# Altium project Buck Converter.PrjPcb
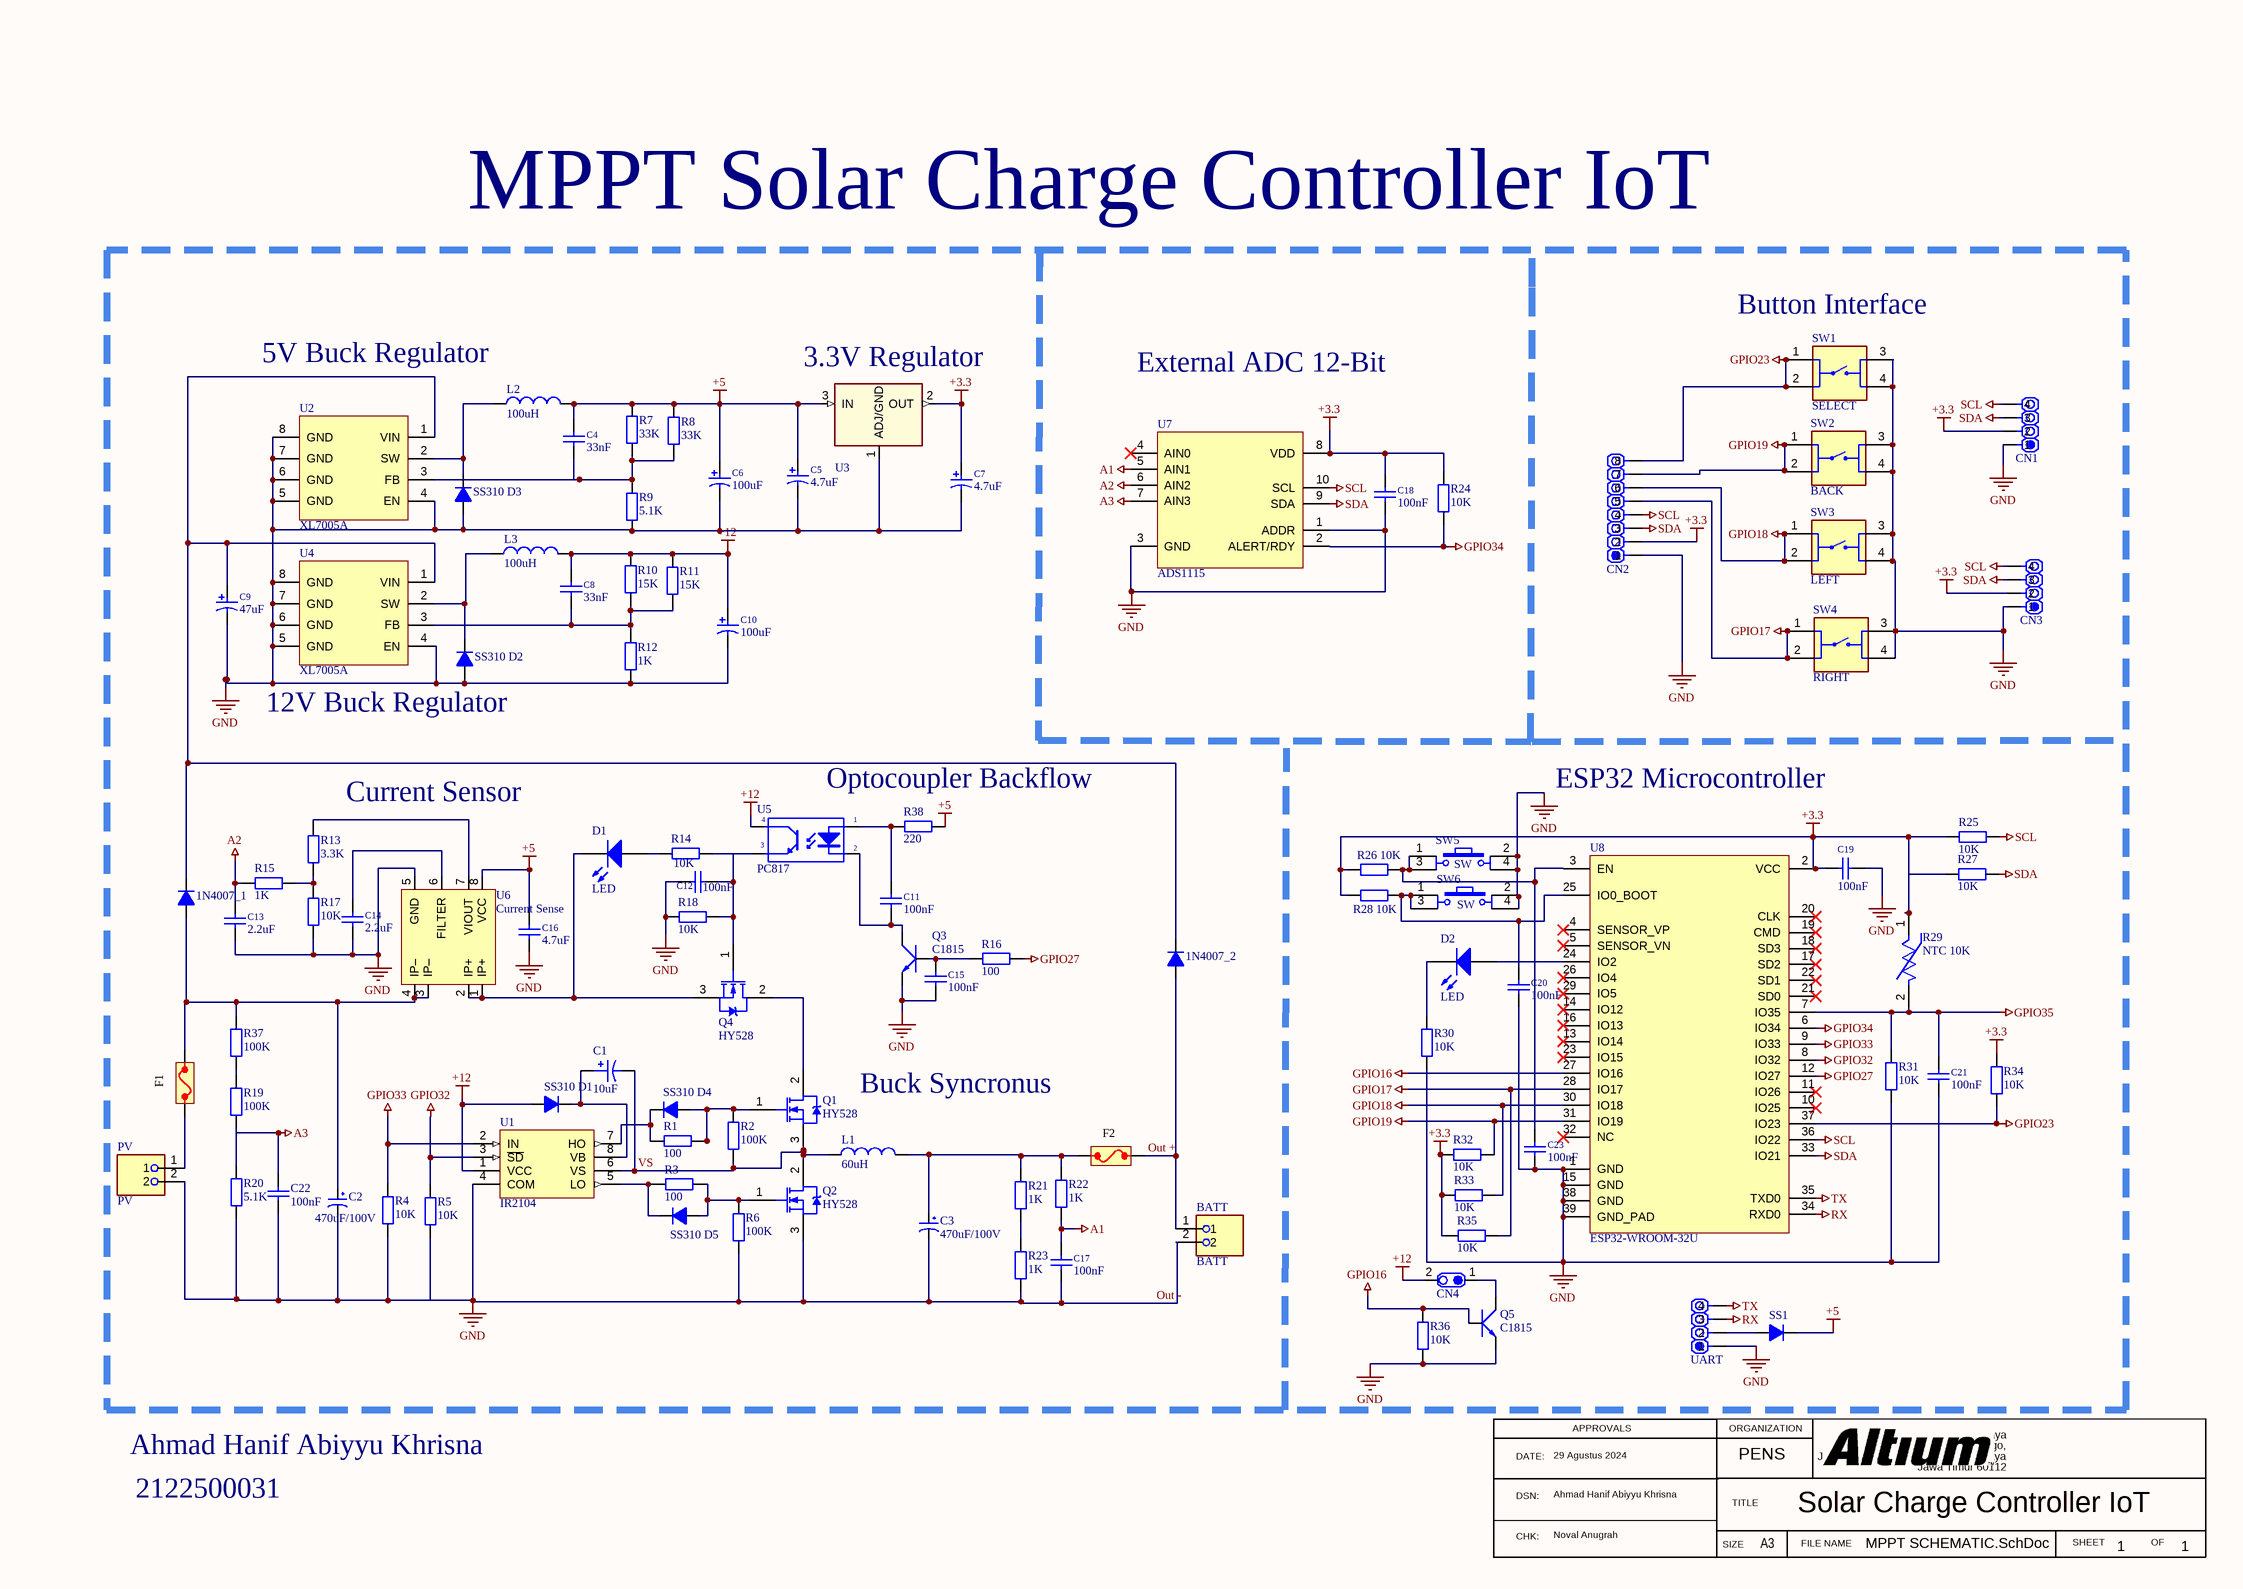
[diagram p0: MPPT SCHEMATIC.SchDoc]
1 sheet, 102 parts. Net scope: global (net labels, ports and power ports of the same name join across sheets).
Board files: MPPT PCB.PcbDoc, ButtonInterface.PcbDoc, Project MPPT.PcbDoc

## Sheet MPPT SCHEMATIC.SchDoc: Solar Charge Controller IoT
size 420 x 297 mm; Date: 29 Agustus 2024; CheckedBy: Noval Anugrah; DrawnBy: Ahmad Hanif Abiyyu Khrisna; Engineer: Ahmad Hanif Abiyyu Khrisna; Organization: PENS; Address1: PT Agraprana Cahya Wijaya; Address2: Pakuwon City Cluster San Diego,; Address3: Jalan Kalisari Permai M3-27, Surabaya; Address4: Jawa Timur 60112; SheetNumber: 1; SheetTotal: 1; CHK_APP_DATE: --/--/--; ENG_APP_DATE: --/--/--

### Parts
1N4007_1  Diode  [DO-214AA,SMB]  (value not drawn)
1N4007_2  1N4007  [DO-214AA,SMB]  (value not drawn)
BATT  BATT  [PHOENIX_1904147]
C1  value 10uF  [RADIAL C]  (hidden comment: Cap Pol)
C2  470uF/100V  [CP3/7]
C3  470uF/100V  [CP3/7]
C4  33nF  [C2012-0805]
C5  4.7uF  [Cap_smd_4_3MM_N]
C6  100uF  [CAP_SMD_6_3MM_N]
C7  4.7uF  [CAP_SMD_6_3MM_N]
C8  33nF  [C2012-0805]
C9  47uF  [CAP_SMD_10MM]
C10  100uF  [CAP_SMD_6_3MM_N]
C11  100nF  [C2012-0805]
C12  100nF  [C2012-0805]
C13  2.2uF  [C2012-0805]
C14  2.2uF  [C2012-0805]
C15  100nF  [C2012-0805]
C16  4.7uF  [C2012-0805]
C17  100nF  [C2012-0805]
C18  100nF  [C2012-0805]
C19  100nF  [C2012-0805]
C20  100nF  [C2012-0805]
C21  100nF  [C2012-0805]
C22  100nF  [C2012-0805]
C23  100nF  [C2012-0805]
CN1  IO  [CON.HDR1X4]  (value not drawn)
CN2  CON.HDR1x8  [CON1X8N]  (value not drawn)
CN3  IO  [CON.HDR1X4]  (value not drawn)
CN4  IO  [CON.HDR1X2]  (value not drawn)
D1  LED  [LED-0 3mm YELLOW]
D2  LED  [LED-0 3mm YELLOW]
F1  FUSE  [FUSE 24.5x9.5]  (value not drawn)
F2  FUSE  [FUSE 24.5x9.5]  (value not drawn)
L1  60uH  [104836]
L2  value 100uH  [RH127]  (hidden comment: Inductor)
L3  value 100uH  [RH127]  (hidden comment: Inductor)
PV  PV  [PHOENIX_1904147]
Q1  HY528  [TO-247]
Q2  HY528  [TO-247]
Q3  C1815  [SOT23B]
Q4  HY528  [TO-247]
Q5  C1815  [SOT23B]
R1  100  [SM-0805]
R2  100K  [SM-0805]
R3  100  [SM-0805]
R4  10K  [SM-0805]
R5  10K  [SM-0805]
R6  100K  [SM-0805]
R7  33K  [SM-0805]
R8  33K  [SM-0805]
R9  5.1K  [SM-0805]
R10  15K  [SM-0805]
R11  15K  [SM-0805]
R12  1K  [SM-0805]
R13  3.3K  [SM-0805]
R14  10K  [SM-0805]
R15  1K  [SM-0805]
R16  100  [SM-0805]
R17  10K  [SM-0805]
R18  10K  [SM-0805]
R19  100K  [SM-0805]
R20  5.1K  [SM-0805]
R21  1K  [SM-0805]
R22  1K  [SM-0805]
R23  1K  [SM-0805]
R24  10K  [SM-0805]
R25  10K  [SM-0805]
R26  10K  [SM-0805]
R27  10K  [SM-0805]
R28  10K  [SM-0805]
R29  NTC 10K  [FP-NTCLE100E3104JB0-MFG]
R30  10K  [SM-0805]
R31  10K  [SM-0805]
R32  10K  [SM-0805]
R33  10K  [SM-0805]
R34  10K  [SM-0805]
R35  10K  [SM-0805]
R36  10K  [SM-0805]
R37  100K  [SM-0805]
R38  220  [SM-0805]
SS1  Diode  [DO-214AA,SMB]  (value not drawn)
SS310_D1  Diode  [DO-214AA,SMB]  (value not drawn)
SS310_D2  Diode  [DO-214AA,SMB]  (value not drawn)
SS310_D3  Diode  [DO-214AA,SMB]  (value not drawn)
SS310_D4  Diode  [DO-214AA,SMB]  (value not drawn)
SS310_D5  Diode  [DO-214AA,SMB]  (value not drawn)
SW1  SELECT  [SW_1825910-6-4]
SW2  BACK  [SW_1825910-6-4]
SW3  LEFT  [SW_1825910-6-4]
SW4  RIGHT  [SW_1825910-6-4]
SW5  SW  [SW4]
SW6  SW  [SW4]
U1  IR2104  [DIP-8]
U2  XL7005A  [SOIC-8N]
U3  LM1117MP-3.3TR  [SOT-223 3N]  (value not drawn)
U4  XL7005A  [SOIC-8N]
U5  PC817  [DIP4/W0.3]
U6  Current Sense  [SOIC8N]
U7  ADS1115  [MSOP-10]
U8  ESP32-WROOM-32U  [ESP32-32U]
UART  IO  [CON.HDR1X4]  (value not drawn)

### Nets
+3.3: C7.1 C18.2 C19.1 CN1.2 CN2.2 CN3.2 R24.1 R25.2 R26.2 R27.2 R28.2 R29.1 R32.1 R33.2 R34.2 R35.2 U3.2(OUT) U7.8(VDD) U8.2(VCC)
+5: C4.2 C5.1 C6.1 C16.1 L2.2 R7.2 R8.2 R38.1 SS1.2(K) U3.3(IN) U6.8(VCC)
+12: C8.2 C10.1 CN4.2 L3.2 R10.2 R11.2 SS310_D1.1(A) U1.1(VCC) U5.4(C)
A1: C17.1 R22.1 U7.5(AIN1)
A2: C13.1 R15.2 U7.6(AIN2)
A3: C22.1 R19.1 R20.2 U7.7(AIN3)
GPIO16: Q5.3(B) R36.2 U8.27(IO16)
GPIO17: CN2.5 R35.1 SW4.1 SW4.2 U8.28(IO17)
GPIO18: CN2.6 R33.1 SW3.1 SW3.2 U8.30(IO18)
GPIO19: CN2.7 R32.2 SW2.1 SW2.2 U8.31(IO19)
GPIO23: CN2.8 R34.1 SW1.1 SW1.2 U8.37(IO23)
GPIO27: R16.1 U8.12(IO27)
GPIO32: R5.2 U1.3(~{SD}) U8.8(IO32)
GPIO33: R4.2 U1.2(IN) U8.9(IO33)
GPIO34: R24.2 U7.2(ALERT/RDY) U8.6(IO34)
GPIO35: C21.2 R29.2 R31.1 U8.7(IO35)
Out -: BATT.2 C2.2 C3.2 C5.2 C6.2 C7.2 C9.2 C10.2 C12.2 C13.2 C14.2 C15.1 C16.2 C17.2 C18.1 C19.2 C20.1 C21.1 C22.2 C23.1 CN1.1 CN2.1 CN3.1 PV.2 Q2.3(S) Q3.1(E) Q5.1(E) R4.1 R5.1 R6.1 R9.1 R12.1 R17.1 R18.2 R20.1 R23.1 R30.2 R31.2 R36.1 SS310_D2.1(A) SS310_D3.1(A) SW1.3 SW1.4 SW2.3 SW2.4 SW3.3 SW3.4 SW4.3 SW4.4 SW5.2 SW5.4 SW6.2 SW6.4 U1.4(COM) U2.4(EN) U2.5(GND) U2.6(GND) U2.7(GND) U2.8(GND) U3.1(ADJ/GND) U4.4(EN) U4.5(GND) U4.6(GND) U4.7(GND) U4.8(GND) U6.5(GND) U7.1(ADDR) U7.3(GND) U8.1(GND) U8.15(GND) U8.38(GND) U8.39(GND_PAD) UART.1  [also labelled GND]
RX: U8.34(RXD0) UART.3
SCL: CN1.4 CN2.4 CN3.4 R25.1 U7.10(SCL) U8.36(IO22)
SDA: CN1.3 CN2.3 CN3.3 R27.1 U7.9(SDA) U8.33(IO21)
TX: U8.35(TXD0) UART.4
Out +: 1N4007_2.1(A) BATT.1 F2.2
VS: C1.2 L1.P$1 Q1.3(S) Q2.2(D) R2.1 U1.6(VS)
Net1N4007_1_1: 1N4007_1.1(A) C2.1 F1.2 R37.2 U6.3(IP–) U6.4(IP–)
Net1N4007_1_2: 1N4007_1.2(K) 1N4007_2.2(K) C9.1 U2.1(VIN) U4.1(VIN)
NetC1_1: C1.1 SS310_D1.2(K) U1.8(VB)
NetC3_1: C3.1 F2.1 L1.P$2 R21.2 R22.2
NetC4_1: C4.1 R7.1 R8.1 R9.2 U2.3(FB)
NetC8_1: C8.1 R10.1 R11.1 R12.2 U4.3(FB)
NetC11_1: C11.1 Q3.2(C) U5.2(K)
NetC11_2: C11.2 R38.2 U5.1(A)
NetC12_1: C12.1 Q4.1(G) R14.1 R18.1 U5.3(E)
NetC14_1: C14.1 U6.6(FILTER)
NetC15_2: C15.2 Q3.3(B) R16.2
NetC20_2: C20.2 R28.1 SW6.1 SW6.3 U8.25(IO0_BOOT)
NetC23_2: C23.2 R26.1 SW5.1 SW5.3 U8.3(EN)
NetCN4_1: CN4.1 Q5.2(C)
NetD1_1: D1.1(A) R14.2
NetD1_2: D1.2(K) Q4.3(S) U6.1(IP+) U6.2(IP+)
NetD2_1: D2.1(A) U8.24(IO2)
NetD2_2: D2.2(K) R30.1
NetF1_1: F1.1 PV.1
NetL2_1: L2.1 SS310_D3.2(K) U2.2(SW)
NetL3_1: L3.1 SS310_D2.2(K) U4.2(SW)
NetQ1_1: Q1.1(G) R1.2 R2.2 SS310_D4.1(A)
NetQ1_2: Q1.2(D) Q4.2(D)
NetQ2_1: Q2.1(G) R3.2 R6.2 SS310_D5.1(A)
NetR1_1: R1.1 SS310_D4.2(K) U1.7(HO)
NetR3_1: R3.1 SS310_D5.2(K) U1.5(LO)
NetR13_1: R13.1 R15.1 R17.2
NetR13_2: R13.2 U6.7(VIOUT)
NetR19_2: R19.2 R37.1
NetR21_1: R21.1 R23.2
NetSS1_1: SS1.1(A) UART.2

Not connected (* = marked no-connect by the designer): U7 4(AIN0)*; U8 4(SENSOR_VP)* 5(SENSOR_VN)* 10(IO25)* 11(IO26)* 13(IO14)* 14(IO12)* 16(IO13)* 17(SD2)* 18(SD3)* 19(CMD)* 20(CLK)* 21(SD0)* 22(SD1)* 23(IO15)* 26(IO4)* 29(IO5)* 32(NC)*

### Notes on the sheet
- MPPT Solar Charge Controller IoT
- (near SW1) Button Interface
- (near L2) 5V Buck Regulator
- (near U3) 3.3V Regulator
- External ADC 12-Bit
- (near SS310_D2) 12V Buck Regulator
- Optocoupler Backflow
- ESP32 Microcontroller
- (near R13) Current Sensor
- Buck Syncronus
- Ahmad Hanif Abiyyu Khrisna
- DATE:
- APPROVALS
- ORGANIZATION
- 2122500031
- DSN:
- CHK:
- SIZE
- TITLE
- A3
- FILE NAME
- SHEET
- OF
- THIS DOCUMENT AND THE DATA DISCLOSED HEREIN OR
- HEREWITH IS THE PROPERTY OF ALTIUM LIMITED AND MAY
- DWG NO:
- REVISION
- REV:
- DESCRIPTION
- DATE
- APPROVED
- BE FREELY DISTRIBUTED IN WHOLE. NO RIGHTS ARE
- RESERVED OR EXPRESS OR IMPLIED WARANTEE GIVEN.
- ENG:
- PROJECT
- REFERENCE DOCUMENTS
- PROJECT REVISION:
- DOCUMENT REVISION:
- DESIGN ITEM:
- BOM:
- FAB DWG:
- PCB DWG:
- ASSY DWG:
- SCALE:
- CAGE CODE
- DWG NO.
- REV

### Library data of the parts
1N4007_1 1N4007_2 SS1 SS310_D1-SS310_D5 = Diode: Vendor: Digikey; Value: FRxxx; Published: 8-Jun-2000; LatestRevisionDate: 17-Jul-2002; LatestRevisionNote: Re-released for DXP Platform.; DatasheetDocument: 1997; PackageReference: DO-35; Publisher: Altium Limited; Code_JEDEC: DO-204-AH; ComponentLink1Description: Digikey Part Link; ComponentLink1URL: http://www.fairchildsemi.com/; ComponentLink2Description: Open Datasheet; ComponentLink2URL: H:\LIBRARY\LIBRARY.Datasheet\ds26003.pdf
BATT PV = 1904147: PCB Terminal Screw 9.52mm 10AWG 1000V 32A 2 Position Combicon Power Series | Phoenix Contact 1904147; SnapEDA_Link: https://www.snapeda.com/parts/1904147/Phoenix+Contact/view-part/?ref=snap; Package: None; Value: *; MF: Phoenix Contact; MP: 1904147; Check_prices: https://www.snapeda.com/parts/1904147/Phoenix+Contact/view-part/?ref=eda
C1 = Cap Pol: Polarized Capacitor; Published: 8-Jun-2000; LatestRevisionDate: 17-Jul-2002; LatestRevisionNote: Re-released for DXP Platform.; PackageReference: POLAR0.8; Publisher: Altium Limited
C2 C3 = CP6: Cap 4700uF/16V - 2200uF/50V; Description 5: 100uF=>220uF/200V -100uF=>330uF/350V; Description 1: 10KuF=>22KuF/6,3V - 6800uF=>15KuF/10V; Description 2: 4700uF=>10KuF/16V - 3300uF => 6800uF/25V; Description 3: 2200uF=>3300uF/50V_1KuF=>2200uF/63V; Description 4: 470uF => 1KuF/100V - 220uF-470uF/160V; Value: 2200uF/16V; Description 6: 33uF=>100/350V-400V  -  22uF=>33uF/450V
C4 C8 C11-C23 = Capacitor: AEMS Code: 2100341; Vendor: Digikey; Volt: 16V; Published: 13-April-2009; Publisher: Hoang Nguyen; ComponentLink1Description: Digikey Part Link; ComponentLink2Description: Open Datasheet; ComponentLink2URL: H:\LIBRARY\LIBRARY.Datasheet\
  C4 C8: Value: 33nF
  C11 C12 C15 C17-C23: Value: 100nF
  C13 C14: Value: 2.2uF
  C16: Value: 4.7uF
C5-C7 C10 = Cap_Pol: Polarized Capacitor; Manufacturer: FARNELL; AEMS Code: 2100110; Vendor: Digikey; Capacitor Type: Tant; Volt: 25V; Published: 13-April-2009; Publisher: Hoang Nguyen; ComponentLink1Description: Digikey Part Link; ComponentLink2Description: Open Datasheet; ComponentLink2URL: H:\LIBRARY\LIBRARY.Datasheet\
  C5 C7: Value: 4.7uF
  C6 C10: Value: 100uF
C9 = Cap_Pol: Polarized Capacitor; Manufacturer: FARNELL; AEMS Code: 2100110; Vendor: Digikey; Published: 13-April-2009; Publisher: Hoang Nguyen; ComponentLink1Description: Digikey Part Link; ComponentLink2Description: Open Datasheet; ComponentLink2URL: H:\LIBRARY\LIBRARY.Datasheet\; Volt: 47uF; Value: 47uF
CN1 CN3 UART = CON.HDR1x4: Header 1x4; Publisher: Hoang Nguyen; ComponentLink1Description: Digikey Part link; ComponentLink2Description: Open DataSheet; ComponentLink2URL: H:\LIBRARY\LIBRARY.Datasheet\
CN2 = CON.HDR1x8: Header 1x8; Publisher: Hoang Nguyen; ComponentLink1Description: Digikey Part link; ComponentLink2Description: Open DataSheet; ComponentLink2URL: H:\LIBRARY\LIBRARY.Datasheet\
CN4 = CON.HDR1x2: Header 1x2; Publisher: Hoang Nguyen; ComponentLink1Description: Digikey Part link; ComponentLink2Description: Open DataSheet; ComponentLink2URL: H:\LIBRARY\LIBRARY.Datasheet\
D1 D2 = LED: Typical LED; Published: 8-Jun-2000; LatestRevisionDate: 08-Jul-2005; LatestRevisionNote: Mech Layer 1 removed.; PackageReference: LED-1; Publisher: Altium Limited
F1 F2 = FUSE_1: Vendor: Digikey; Value: *; Published: 13-April-2009; Publisher: Hoang Nguyen; ComponentLink1Description: Digikey Part Link; ComponentLink2Description: Open Datasheet; ComponentLink2URL: H:\LIBRARY\LIBRARY.Datasheet\
L1 = 1048436: Toroidal Power Inductor 100uH 3A 80mOhms Radial Leaded Mount 25 x 12mm; MF: RS Pro; SnapEDA_Link: https://www.snapeda.com/parts/1048436/RS+Pro/view-part/?ref=snap; Check_prices: https://www.snapeda.com/parts/1048436/RS+Pro/view-part/?ref=eda; MP: 1048436; Availability: In Stock; Package: None; Price: None; Value: *
L2 L3 = Inductor: Code_IEC: 1005; Published: 8-Jun-2000; LatestRevisionDate: 17-Jul-2002; LatestRevisionNote: Re-released for DXP Platform.; PackageReference: 0402-A; Publisher: Altium Limited; Code_JEITA: 0402
Q1 Q2 Q4 = IRFP460: HEXFET Power MOSFET; Note: Pin 2 is electrically connected to the Heatsink (4).; Published: 8-Jun-2000; LatestRevisionDate: 17-Jul-2002; LatestRevisionNote: Re-released for DXP Platform.; DatasheetVersion: PD-9.512B; PackageVersion: Aug-1997; PackageReference: TO-247AC; Publisher: Altium Limited; PackageDescription: SIP with Mounting Hole; 3 Leads; Body 20 x 15.6 x 5 mm (typ); Pitch 5.45 mm; Code_JEDEC: TO-247-AC; ComponentLink1Description: Manufacturer Link; ComponentLink1URL: http://www.irf.com/; ComponentLink2Description: Datasheet; ComponentLink2URL: http://www.irf.com/product-info/datasheets/data/irfp460.pdf
Q3 Q5 = C1815_1: NPN 600mW, ECB; Value: C1815
R1-R11 R13 R14 R16-R20 R24-R28 R30-R38 = RM: Resistor SMD; Value: 1K
R12 R15 R21-R23 = RM: Resistor SMD; Value: 1K
R29 = CMP-02404-000021-1: NTC THERMISTOR 100K OHM 5% BEAD; Lead Diameter: 0.6mm; Accuracy: 1.5%; Max Power Dissipation: 500mW; Lead Length: 17mm; Resistance: 100kR; Package Quantity: 500; Resistance Tolerance: 5%; Height: 9mm; Case/Package: Radial; Depth: 3mm; Lead Free: Lead Free; Tolerance: 5%; Number of Pins: 2; RoHS Compliant: Yes; Lead Pitch: 2.54mm; Min Operating Temperature: -40°C; Termination: Radial; Series: 2322; Length: 3.3mm; Radiation Hardening: No; Mount: Through Hole; Max Operating Temperature: 125°C; Packaging: Bulk
SW1-SW4 = 1825910-6: Switch Push Button OFF (ON) SPST Round Button 0.05A 24VDC Momentary Contact PC Pins Thru-Hole; MF: TE Connectivity; Value: *; MP: 1825910-6; Package: None; Check_prices: https://www.snapeda.com/parts/1825910-6/TE+Connectivity+ALCOSWITCH+Switches/view-part/?ref=eda; SnapEDA_Link: https://www.snapeda.com/parts/1825910-6/TE+Connectivity+ALCOSWITCH+Switches/view-part/?ref=snap; Digi-Key_Part_Number: 450-1650-ND; Purchase-URL: https://pricing.snapeda.com/search/part/1825910-6/?ref=eda
SW5 SW6 = SW4: Switch button 4 pin; Value: Button chip 4 pin
U1 = IR2104: High and Low Side Driver; Published: 8-Jun-2000; LatestRevisionDate: 04-Mar-2005; LatestRevisionNote: Stylized 3D Model Added.; DatasheetDocument: PD600461; PackageReference: PDIP8; Publisher: Altium Limited; Code_JEDEC: MO-001-AN; ComponentLink1Description: Manufacturer Link; ComponentLink1URL: http://www.irf.com/; ComponentLink2Description: Datasheet; ComponentLink2URL: http://www.irf.com/product-info/datasheets/data/ir2104.pdf
U2 U4 = XL7005A: XL7005A - Buck Converter
U3 = LM1117MP-3.3TR: 3.3V 800mA Low-Dropout Linear Regulator; PSpiceTemplate: X^@REFDES %IN %OUT %GND @MODEL; Vendor: Digikey; Volt (Max): 20V; Publisher: Hoang Nguyen; ComponentLink1URL: http://search.digikey.com/scripts/DkSearch/dksus.dll?Detail&name=LM1117MP-3.3TR-ND; ComponentLink1Description: Digikey Part Link; ComponentLink2Description: Open Datasheet; ComponentLink2URL: H:\LIBRARY\LIBRARY.Datasheet\LM1117.pdf; Published: 13-April-2009; V out: 3.3V; Output Current (max): 800mA; Price: 4.000 VND
U5 = PC817_1: Single Opto; Value: PC817
U6 = ACS712_xxA: Current Sense IC
U7 = ADS1115: Ultra-Small, Low-Power, 16-Bit / Analog-to-Digital Converter with Internal Reference